# Altium schematic sheet PD_Controller.SchDoc
size A4
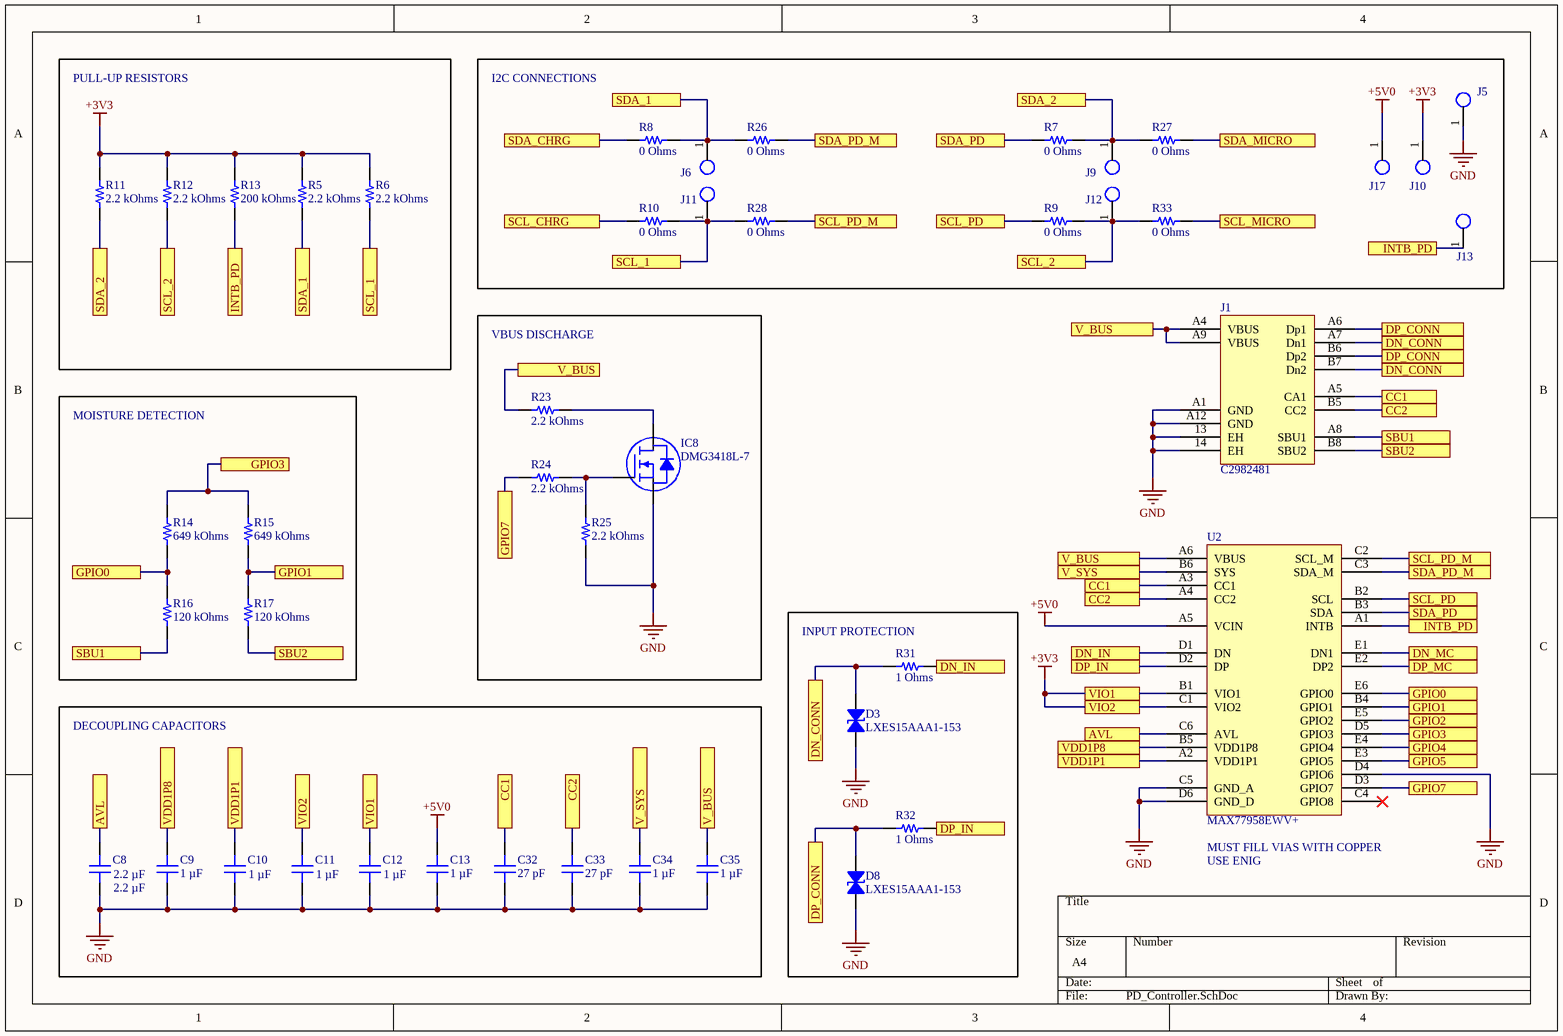
[diagram p0: PD_Controller.SchDoc]

## Parts
C8  2.2 µF  [CAP 0402_1005]
C9  1 µF  [CAP 0402_1005]
C10  1 µF  [CAP 0402_1005]
C11  1 µF  [CAP 0402_1005]
C12  1 µF  [CAP 0402_1005]
C13  1 µF  [CAP 0402_1005]
C32  27 pF  [CAP 0402_1005]
C33  27 pF  [CAP 0402_1005]
C34  1 µF  [CAP 0402_1005]
C35  1 µF  [CAP 0402_1005]
D3  LXES15AAA1-153  [0402]
D8  LXES15AAA1-153  [0402]
IC8  DMG3418L-7  [DIODES SOT-23-3]
J1  C2982481  [GT-USB-7079A]
J5  Small Board Solder Point  [Small Solder POint]  (value not drawn)  (no BOM)
J6  Small Board Solder Point  [Small Solder POint]  (value not drawn)  (no BOM)
J9  Small Board Solder Point  [Small Solder POint]  (value not drawn)  (no BOM)
J10  Small Board Solder Point  [Small Solder POint]  (value not drawn)  (no BOM)
J11  Small Board Solder Point  [Small Solder POint]  (value not drawn)  (no BOM)
J12  Small Board Solder Point  [Small Solder POint]  (value not drawn)  (no BOM)
J13  Small Board Solder Point  [Small Solder POint]  (value not drawn)  (no BOM)
J17  Small Board Solder Point  [Small Solder POint]  (value not drawn)  (no BOM)
R5  2.2 kOhms  [RES 0402_1005]
R6  2.2 kOhms  [RES 0402_1005]
R7  0 Ohms  [RES 0603_1608]
R8  0 Ohms  [RES 0603_1608]
R9  0 Ohms  [RES 0603_1608]
R10  0 Ohms  [RES 0603_1608]
R11  2.2 kOhms  [RES 0402_1005]
R12  2.2 kOhms  [RES 0402_1005]
R13  200 kOhms  [RES 0402_1005]
R14  649 kOhms  [RES 0402_1005]
R15  649 kOhms  [RES 0402_1005]
R16  120 kOhms  [RES 0402_1005]
R17  120 kOhms  [RES 0402_1005]
R23  2.2 kOhms  [RES 0805_2012]
R24  2.2 kOhms  [RES 0402_1005]
R25  2.2 kOhms  [RES 0402_1005]
R26  0 Ohms  [RES 0603_1608]
R27  0 Ohms  [RES 0603_1608]
R28  0 Ohms  [RES 0603_1608]
R31  1 Ohms  [RES 0402_1005]
R32  1 Ohms  [RES 0402_1005]
R33  0 Ohms  [RES 0603_1608]
U2  MAX77958EWV+  [BGA30C50P6X5_307X262X64]

## Blocks framed on the sheet
PULL-UP RESISTORS: R5 R6 R11-R13
I2C CONNECTIONS: J5 J6 J9-J13 J17 R7-R10 R26-R28 R33
VBUS DISCHARGE: IC8 R23-R25
MOISTURE DETECTION: R14-R17
INPUT PROTECTION: D3 D8 R31 R32
DECOUPLING CAPACITORS: C8-C13 C32-C35

## Ports
AVL, CC1, CC2, DN_CONN, DN_IN, DN_MC, DP_CONN, DP_IN, DP_MC, GPIO0, GPIO1, GPIO2, GPIO3, GPIO4, GPIO5, GPIO7, INTB_PD, SBU1, SBU2, SCL_1, SCL_2, SCL_CHRG, SCL_MICRO, SCL_PD, SCL_PD_M, SDA_1, SDA_2, SDA_CHRG, SDA_MICRO, SDA_PD, SDA_PD_M, V_BUS, V_SYS, VDD1P1, VDD1P8, VIO1, VIO2

## Nets
+3V3: C11.2 C12.2 J10.1 R5.1 R6.1 R11.1 R12.1 R13.2 U2.B1(VIO1) U2.C1(VIO2) ; port VIO2, port VIO1
+5V0: C13.2 J17.1 U2.A5(VCIN)
GND: C8.1 C9.1 C10.1 C11.1 C12.1 C13.1 C32.1 C33.1 C34.1 C35.1 D3.2 D8.2 IC8.2(S) J1.13(EH) J1.14(EH) J1.A1(GND) J1.A12(GND) J5.1 R25.1 U2.C5(GND_A) U2.D4(GPIO6) U2.D6(GND_D)
AVL: C8.2 U2.C6(AVL) ; port AVL
CC1: C32.2 J1.A5(CA1) U2.A3(CC1) ; port CC1
CC2: C33.2 J1.B5(CC2) U2.A4(CC2) ; port CC2
DN_CONN: D3.1 J1.A7(Dn1) J1.B7(Dn2) R31.2 ; port DN_CONN
DN_IN: R31.1 U2.D1(DN) ; port DN_IN
DN_MC: U2.E1(DN1) ; port DN_MC
DP_CONN: D8.1 J1.A6(Dp1) J1.B6(Dp2) R32.2 ; port DP_CONN
DP_IN: R32.1 U2.D2(DP) ; port DP_IN
DP_MC: U2.E2(DP2) ; port DP_MC
GPIO0: R14.1 R16.2 U2.E6(GPIO0) ; port GPIO0
GPIO1: R15.1 R17.2 U2.B4(GPIO1) ; port GPIO1
GPIO2: U2.E5(GPIO2) ; port GPIO2
GPIO3: R14.2 R15.2 U2.D5(GPIO3) ; port GPIO3
GPIO4: U2.E4(GPIO4) ; port GPIO4
GPIO5: U2.E3(GPIO5) ; port GPIO5
GPIO7: R24.1 U2.D3(GPIO7) ; port GPIO7
INTB_PD: J13.1 R13.1 U2.A1(INTB) ; port INTB_PD
SBU1: J1.A8(SBU1) R16.1 ; port SBU1
SBU2: J1.B8(SBU2) R17.1 ; port SBU2
SCL_1: J11.1 R6.2 R10.2 R28.1 ; port SCL_1
SCL_2: J12.1 R9.2 R12.2 R33.1 ; port SCL_2
SCL_CHRG: R10.1 ; port SCL_CHRG
SCL_MICRO: R33.2 ; port SCL_MICRO
SCL_PD: R9.1 U2.B2(SCL) ; port SCL_PD
SCL_PD_M: R28.2 U2.C2(SCL_M) ; port SCL_PD_M
SDA_1: J6.1 R5.2 R8.2 R26.1 ; port SDA_1
SDA_2: J9.1 R7.2 R11.2 R27.1 ; port SDA_2
SDA_CHRG: R8.1 ; port SDA_CHRG
SDA_MICRO: R27.2 ; port SDA_MICRO
SDA_PD: R7.1 U2.B3(SDA) ; port SDA_PD
SDA_PD_M: R26.2 U2.C3(SDA_M) ; port SDA_PD_M
V_BUS: C35.2 J1.A4(VBUS) J1.A9(VBUS) R23.1 U2.A6(VBUS) ; port V_BUS
V_SYS: C34.2 U2.B6(SYS) ; port V_SYS
VDD1P1: C10.2 U2.A2(VDD1P1) ; port VDD1P1
VDD1P8: C9.2 U2.B5(VDD1P8) ; port VDD1P8
NetIC8_1: IC8.1(G) R24.2 R25.2
NetIC8_3: IC8.3(D) R23.2

Not connected (* = marked no-connect by the designer): U2 C4(GPIO8)*

## Notes on the sheet
- (near U2) MUST FILL VIAS WITH COPPER
- USE ENIG

## Library data of the parts
C8 = CL05A225KP7NSB8: CAP CER 2.2UF 10V X5R 0402; manufacturer: Samsung Electro-Mechanics; Tolerance: ±10%; Part Number: CL05A225KP7NSB8; Value: 2.2 µF; Applications: General Purpose; Capacitance: 2.2 µF; componentlink1description: Datasheet; componentlink1url: http://www.samsungsem.com/kr/support/product-search/mlcc/CL05A225KP7NSB8.jsp; componentlink2description: DigiKey Link; componentlink2url: https://www.digikey.com/en/products/detail/samsung-electro-mechanics/CL05A225KP7NSB8/5961304; Device Package: 0402 (1005 Metric); lastupdated: 9/08/2022 12:01:17 PM; Lifecycle Status: Active; Minimum Order: 1; Mounting Type: Surface Mount, MLCC; Operating Temperature: -55°C ~ 85°C; Package / Case: 0402 (1005 Metric); packaging: TapeAndReel; partid: 1994; Part Status: Active; price: 0.05; series: CL; Size / Dimension: 0.039" L x 0.020" W (1.00mm x 0.50mm); Supplier 1: DigiKey; Supplier Part Number 1: 1276-6820-1-ND; Temperature Coefficient: X5R; Thickness (Max): 0.031" (0.80mm); Voltage - Rated: 10V
C9-C12 = JMK105BJ105MVHF: CAP CER 1UF 6.3V X5R 0402; manufacturer: Taiyo Yuden; Tolerance: ±20%; Part Number: JMK105BJ105MVHF; Value: 1 µF; Applications: Automotive, SMPS Filtering; Capacitance: 1 µF; componentlink1description: Datasheet; componentlink1url: https://ds.yuden.co.jp/TYCOMPAS/ut/detail?pn=JMK105BJ105MVHF &u=M; componentlink2description: DigiKey Link; componentlink2url: https://www.digikey.com/en/products/detail/taiyo-yuden/JMK105BJ105MVHF/7403909; Device Package: 0402 (1005 Metric); lastupdated: 9/08/2022 12:01:17 PM; Lifecycle Status: Active; Minimum Order: 1; Mounting Type: Surface Mount, MLCC; Operating Temperature: -55°C ~ 85°C; Package / Case: 0402 (1005 Metric); packaging: TapeAndReel; partid: 1876; Part Status: Active; price: 0.01; Ratings: AEC-Q200; series: M; Size / Dimension: 0.039" L x 0.020" W (1.00mm x 0.50mm); Supplier 1: DigiKey; Supplier Part Number 1: 587-6273-1-ND; Temperature Coefficient: X5R; Thickness (Max): 0.022" (0.55mm); Voltage - Rated: 6.3V
C13 = 885012105012: CAP CER 1UF 10V X5R 0402; manufacturer: Würth Elektronik; Tolerance: ±20%; Part Number: 885012105012; Value: 1 µF; Applications: General Purpose; Capacitance: 1 µF; componentlink1description: Datasheet; componentlink1url: https://katalog.we-online.de/pbs/datasheet/885012105012.pdf; componentlink2description: DigiKey Link; componentlink2url: https://www.digikey.com/en/products/detail/würth-elektronik/885012105012/5453344; Device Package: 0402 (1005 Metric); lastupdated: 9/08/2022 12:01:18 PM; Lifecycle Status: Active; Minimum Order: 1; Mounting Type: Surface Mount, MLCC; Operating Temperature: -55°C ~ 85°C; Package / Case: 0402 (1005 Metric); packaging: TapeAndReel; partid: 1807; Part Status: Active; price: 0.16; series: WCAP-CSGP; Size / Dimension: 0.039" L x 0.020" W (1.00mm x 0.50mm); Supplier 1: DigiKey; Supplier Part Number 1: 732-7489-1-ND; Temperature Coefficient: X5R; Thickness (Max): 0.022" (0.55mm); Voltage - Rated: 10V
C32 C33 = 500R07S270GV4T: CAP CER 27PF 50V C0G/NP0 0402; manufacturer: Johanson Technology Inc.; Temperature Coefficient: C0G, NP0; Tolerance: ±2%; Part Number: 500R07S270GV4T; Value: 27 pF; Applications: RF, Microwave, High Frequency; Capacitance: 27 pF; componentlink1description: Datasheet; componentlink1url: https://www.johansontechnology.com/downloads/catalog/johanson-technology-multi-layer-high-q-capacitors.pdf; componentlink2description: DigiKey Link; componentlink2url: https://www.digikey.com/en/products/detail/johanson-technology-inc/500R07S270GV4T/1561561; Device Package: 0402 (1005 Metric); Features: High Q, Low Loss, Ultra Low ESR; lastupdated: 9/08/2022 12:01:16 PM; Lifecycle Status: Active; Minimum Order: 1; Mounting Type: Surface Mount, MLCC; Operating Temperature: -55°C ~ 125°C; Package / Case: 0402 (1005 Metric); packaging: TapeAndReel; partid: 2172; Part Status: Active; price: 0.06; series: S; Size / Dimension: 0.040" L x 0.020" W (1.02mm x 0.51mm); Supplier 1: DigiKey; Supplier Part Number 1: 712-1276-1-ND; Thickness (Max): 0.024" (0.61mm); Voltage - Rated: 50V
C34 C35 = CL05A105KL5NRNC: CAP CER 1UF 35V X5R 0402; manufacturer: Samsung Electro-Mechanics; Tolerance: ±10%; Part Number: CL05A105KL5NRNC; Value: 1 µF; Applications: General Purpose; Capacitance: 1 µF; componentlink1description: Datasheet; componentlink1url: http://www.samsungsem.com/kr/support/product-search/mlcc/CL05A105KL5NRNC.jsp; componentlink2description: DigiKey Link; componentlink2url: https://www.digikey.com/en/products/detail/samsung-electro-mechanics/CL05A105KL5NRNC/5961280; Device Package: 0402 (1005 Metric); lastupdated: 9/08/2022 12:01:16 PM; Lifecycle Status: Active; Minimum Order: 1; Mounting Type: Surface Mount, MLCC; Operating Temperature: -55°C ~ 85°C; Package / Case: 0402 (1005 Metric); packaging: TapeAndReel; partid: 2188; Part Status: Active; price: 0.06; series: CL; Size / Dimension: 0.039" L x 0.020" W (1.00mm x 0.50mm); Supplier 1: DigiKey; Supplier Part Number 1: 1276-6796-1-ND; Temperature Coefficient: X5R; Thickness (Max): 0.022" (0.55mm); Voltage - Rated: 35V
D3 D8 = LXES15AAA1-153: TVS DIODE 4V 1005; Manufacturer: Murata Electronics; Bidirectional Channels: 1; Capacitance @ Frequency: 0.05pF @ 1MHz; Power Line Protection: No; Type: Zener; Part Number: LXES15AAA1-153; Applications: General Purpose; ComponentLink1Description: Datasheet; ComponentLink1URL: https://www.murata.com/en-us/products/productdata/8796832759838/CRESD-E.pdf; ComponentLink2Description: DigiKey Link; ComponentLink2URL: http://digikey.com/product-detail/en/murata-electronics/LXES15AAA1-153/490-13210-2-ND/5843762; Device Package: 0402 (1005 Metric); LastUpdated: 9/08/2022 12:53:02 PM; Lifecycle Status: Active; Minimum Order: 0; Mounting Type: Surface Mount; Operating Temperature: -40°C ~ 85°C (TA); Package / Case: 0402 (1005 Metric); Packaging: TapeAndReel; PartId: 10448; Part Status: Active; Price: 0.04; Series: -; Supplier 1: DigiKey; Supplier Part Number 1: 490-13210-2-ND; Supplier Device Package: 1005; Voltage - Reverse Standoff (Typ): 4V
IC8 = DMG3418L-7: MOSFET N-CH 30V 4A SOT23; Manufacturer: Diodes Incorporated; Current - Continuous Drain (Id) @ 25°C: 4A (Ta); Drive Voltage (Max Rds On,  Min Rds On): 2.5V, 10V; FET Type: N-Channel; Gate Charge (Qg) (Max) @ Vgs: 5.5 nC @ 4.5 V; Input Capacitance (Ciss) (Max) @ Vds: 464.3 pF @ 15 V; Power Dissipation (Max): 1.4W (Ta); Rds On (Max) @ Id, Vgs: 60mOhm @ 4A, 10V; Vgs (Max): ±12V; Vgs(th) (Max) @ Id: 1.5V @ 250µA; Part Number: DMG3418L-7; ComponentLink1Description: Datasheet; ComponentLink1URL: https://www.diodes.com/assets/Datasheets/DMG3418L.pdf; ComponentLink2Description: DigiKey Link; ComponentLink2URL: https://www.digikey.com/en/products/detail/diodes-incorporated/DMG3418L-7/4810932; Drain to Source Voltage (Vdss): 30 V; LastUpdated: 21/02/2023 9:02:39 PM; Lifecycle Status: Active; Minimum Order: 1; Mounting Type: Surface Mount; Operating Temperature: -55°C ~ 150°C (TJ); Package / Case: TO-236-3, SC-59, SOT-23-3; Packaging: TapeAndReel; Part Status: Active; Price: 0.10; Series: -; Supplier 1: DigiKey; Supplier Part Number 1: DMG3418L-7DICT-ND; Supplier Device Package: SOT-23-3; Technology: MOSFET (Metal Oxide)
J1 = GT-USB-7079A: 5A 1 Surface Mount 16 Female -55℃~+85℃ Type-C SMD USB Connectors ROHS C2982481
R5 R6 R11 R12 R24 R25 = TNPW04022K20BYEP: RES 2.2K OHM 0.1% 1/10W 0402; Manufacturer: Vishay Dale; Power (Watts): 0.1W, 1/10W; Temperature Coefficient: ±10ppm/°C; Part Number: TNPW04022K20BYEP; Value: 2.2 kOhms; ComponentLink1Description: Datasheet; ComponentLink1URL: http://www.vishay.com/docs/28758/tnpw_e3.pdf; ComponentLink2Description: DigiKey Link; ComponentLink2URL: https://www.digikey.com/en/products/detail/vishay-dale/TNPW04022K20BYEP/8636618; Composition: Thin Film; Device Package: 0402 (1005 Metric); Features: Anti-Sulfur, Automotive AEC-Q200, Moisture Resistant; Height - Seated (Max): 0.016" (0.40mm); LastUpdated: 9/08/2022 12:11:02 PM; Lifecycle Status: Active; Minimum Order: 1; Number of Terminations: 2; Operating Temperature: -55°C ~ 155°C; Package / Case: 0402 (1005 Metric); Packaging: TapeAndReel; PartId: 3077; Part Status: Active; Price: 0.28; Ratings: AEC-Q200; Resistance: 2.2 kOhms; Series: TNPW e3; Size / Dimension: 0.039" L x 0.020" W (1.00mm x 0.50mm); Supplier 1: DigiKey; Supplier Part Number 1: 541-9805-1-ND; Supplier Device Package: 0402; Tolerance: ±0.1%
R7-R10 R26-R28 R33 = RK73Z1JTTD: RES 0 OHM JUMPER 0603; Manufacturer: KOA Speer Electronics, Inc.; Part Number: RK73Z1JTTD; Value: 0 Ohms; ComponentLink1Description: Datasheet; ComponentLink1URL: http://www.koaspeer.com/catimages/Products/RK73Z/RK73Z.pdf; ComponentLink2Description: DigiKey Link; ComponentLink2URL: https://www.digikey.com/en/products/detail/koa-speer-electronics-inc/RK73Z1JTTD/9845478; Composition: Metal Element; Device Package: 0603 (1608 Metric); Features: Automotive AEC-Q200, Moisture Resistant; Height - Seated (Max): 0.022" (0.55mm); LastUpdated: 16/02/2023 8:27:36 PM; Lifecycle Status: Active; Minimum Order: 1; Number of Terminations: 2; Operating Temperature: -55°C ~ 155°C; Package / Case: 0603 (1608 Metric); Packaging: CutTape; PartId: 25658; Part Status: Active; Price: 0.01; Ratings: AEC-Q200; Resistance: 0 Ohms; Series: RK73Z; Size / Dimension: 0.063" L x 0.031" W (1.60mm x 0.80mm); Supplier 1: DigiKey; Supplier Part Number 1: 2019-RK73Z1JTTDCT-ND; Supplier Device Package: 0603; Tolerance: Jumper
R13 = RP73PF1E200KBTD: RES 200K OHM 0.1% 1/10W 0402; Manufacturer: TE Connectivity Passive Product; Power (Watts): 0.1W, 1/10W; Temperature Coefficient: ±25ppm/°C; Part Number: RP73PF1E200KBTD; Value: 200 kOhms; ComponentLink1Description: Datasheet; ComponentLink1URL: https://www.te.com/commerce/DocumentDelivery/DDEController?Action=srchrtrv&DocNm=1773272&DocType=DS&DocLang=English; ComponentLink2Description: DigiKey Link; ComponentLink2URL: https://www.digikey.com/en/products/detail/te-connectivity-passive-product/RP73PF1E200KBTD/8261082; Composition: Thin Film; Device Package: 0402 (1005 Metric); Height - Seated (Max): 0.014" (0.35mm); LastUpdated: 9/08/2022 12:11:04 PM; Lifecycle Status: Active; Minimum Order: 1; Number of Terminations: 2; Operating Temperature: -55°C ~ 155°C; Package / Case: 0402 (1005 Metric); Packaging: TapeAndReel; PartId: 2427; Part Status: Active; Price: 0.09; Resistance: 200 kOhms; Series: RP73, Holsworthy; Size / Dimension: 0.039" L x 0.020" W (1.00mm x 0.50mm); Supplier 1: DigiKey; Supplier Part Number 1: A127540CT-ND; Supplier Device Package: 0402; Tolerance: ±0.1%
R14 R15 = RMCF0402FT649K: RES 649K OHM 1% 1/16W 0402; Manufacturer: Stackpole Electronics Inc; Power (Watts): 0.063W, 1/16W; Temperature Coefficient: ±100ppm/°C; Part Number: RMCF0402FT649K; Value: 649 kOhms; ComponentLink1Description: Datasheet; ComponentLink1URL: https://www.seielect.com/catalog/sei-rmcf_rmcp.pdf; ComponentLink2Description: DigiKey Link; ComponentLink2URL: https://www.digikey.com/en/products/detail/stackpole-electronics-inc/RMCF0402FT649K/1714842; Composition: Thick Film; Device Package: 0402 (1005 Metric); Features: Automotive AEC-Q200; Height - Seated (Max): 0.016" (0.40mm); LastUpdated: 9/08/2022 12:10:57 PM; Lifecycle Status: Active; Minimum Order: 1; Number of Terminations: 2; Operating Temperature: -55°C ~ 155°C; Package / Case: 0402 (1005 Metric); Packaging: CutTape; PartId: 4689; Part Status: Active; Price: 0.01; Ratings: AEC-Q200; Resistance: 649 kOhms; Series: RMCF; Size / Dimension: 0.039" L x 0.020" W (1.00mm x 0.50mm); Supplier 1: DigiKey; Supplier Part Number 1: RMCF0402FT649KCT-ND; Supplier Device Package: 0402; Tolerance: ±1%
R16 R17 = RC0402FR-07120KL: RES 120K OHM 1% 1/16W 0402; Manufacturer: Yageo; Power (Watts): 0.063W, 1/16W; Temperature Coefficient: ±100ppm/°C; Part Number: RC0402FR-07120KL; Value: 120 kOhms; ComponentLink1Description: Datasheet; ComponentLink1URL: https://www.yageo.com/upload/media/product/productsearch/datasheet/rchip/PYu-RC_Group_51_RoHS_L_10.pdf; ComponentLink2Description: DigiKey Link; ComponentLink2URL: https://www.digikey.com/en/products/detail/yageo/RC0402FR-07120KL/726534; Composition: Thick Film; Device Package: 0402 (1005 Metric); Features: Moisture Resistant; Height - Seated (Max): 0.016" (0.40mm); LastUpdated: 9/08/2022 12:11:03 PM; Lifecycle Status: Active; Minimum Order: 1; Number of Terminations: 2; Operating Temperature: -55°C ~ 155°C; Package / Case: 0402 (1005 Metric); Packaging: CutTape; PartId: 2770; Part Status: Active; Price: 0.01; Resistance: 120 kOhms; Series: RC_L; Size / Dimension: 0.039" L x 0.020" W (1.00mm x 0.50mm); Supplier 1: DigiKey; Supplier Part Number 1: 311-120KLRCT-ND; Supplier Device Package: 0402; Tolerance: ±1%
R23 = CRGH0805J2K2: RES SMD 2.2K OHM 5% 1/3W 0805; Manufacturer: TE Connectivity Passive Product; Power (Watts): 0.333W, 1/3W; Temperature Coefficient: ±100ppm/°C; Part Number: CRGH0805J2K2; Value: 2.2 kOhms; ComponentLink1Description: Datasheet; ComponentLink1URL: https://www.te.com/commerce/DocumentDelivery/DDEController?Action=srchrtrv&DocNm=1773204-1&DocType=DS&DocLang=English; ComponentLink2Description: DigiKey Link; ComponentLink2URL: https://www.digikey.com/en/products/detail/te-connectivity-passive-product/CRGH0805J2K2/2385532; Composition: Thick Film; Device Package: 0805 (2012 Metric); LastUpdated: 21/02/2023 8:39:54 PM; Lifecycle Status: Active; Minimum Order: 1; Number of Terminations: 2; Operating Temperature: -55°C ~ 155°C; Package / Case: 0805 (2012 Metric); Packaging: TapeAndReel; PartId: 43744; Part Status: Active; Price: 0.01; Resistance: 2.2 kOhms; Series: CRGH, Neohm; Size / Dimension: 0.083" L x 0.051" W (2.10mm x 1.30mm); Supplier 1: DigiKey; Supplier Part Number 1: A126438CT-ND; Supplier Device Package: 0805; Tolerance: ±5%
R31 R32 = RC0402JR-071RL: RES 1 OHM 5% 1/16W 0402; Manufacturer: Yageo; Power (Watts): 0.063W, 1/16W; Temperature Coefficient: ±200ppm/°C; Part Number: RC0402JR-071RL; Value: 1 Ohms; ComponentLink1Description: Datasheet; ComponentLink1URL: https://www.yageo.com/upload/media/product/productsearch/datasheet/rchip/PYu-RC_Group_51_RoHS_L_10.pdf; ComponentLink2Description: DigiKey Link; ComponentLink2URL: https://www.digikey.com/en/products/detail/yageo/RC0402JR-071RL/726407; Composition: Thick Film; Device Package: 0402 (1005 Metric); Features: Moisture Resistant; Height - Seated (Max): 0.016" (0.40mm); LastUpdated: 9/08/2022 12:11:01 PM; Lifecycle Status: Active; Minimum Order: 1; Number of Terminations: 2; Operating Temperature: -55°C ~ 155°C; Package / Case: 0402 (1005 Metric); Packaging: CutTape; PartId: 3408; Part Status: Active; Price: 0.01; Resistance: 1 Ohms; Series: RC_L; Size / Dimension: 0.039" L x 0.020" W (1.00mm x 0.50mm); Supplier 1: DigiKey; Supplier Part Number 1: 311-1.0JRCT-ND; Supplier Device Package: 0402; Tolerance: ±5%
U2 = MAX77958EWV+: Standalone USB Type-C and USB Power Delivery Controller